# EAGLE design c64-stripefixvidbuf_v0.21-maxIC (EAGLE 6.0)
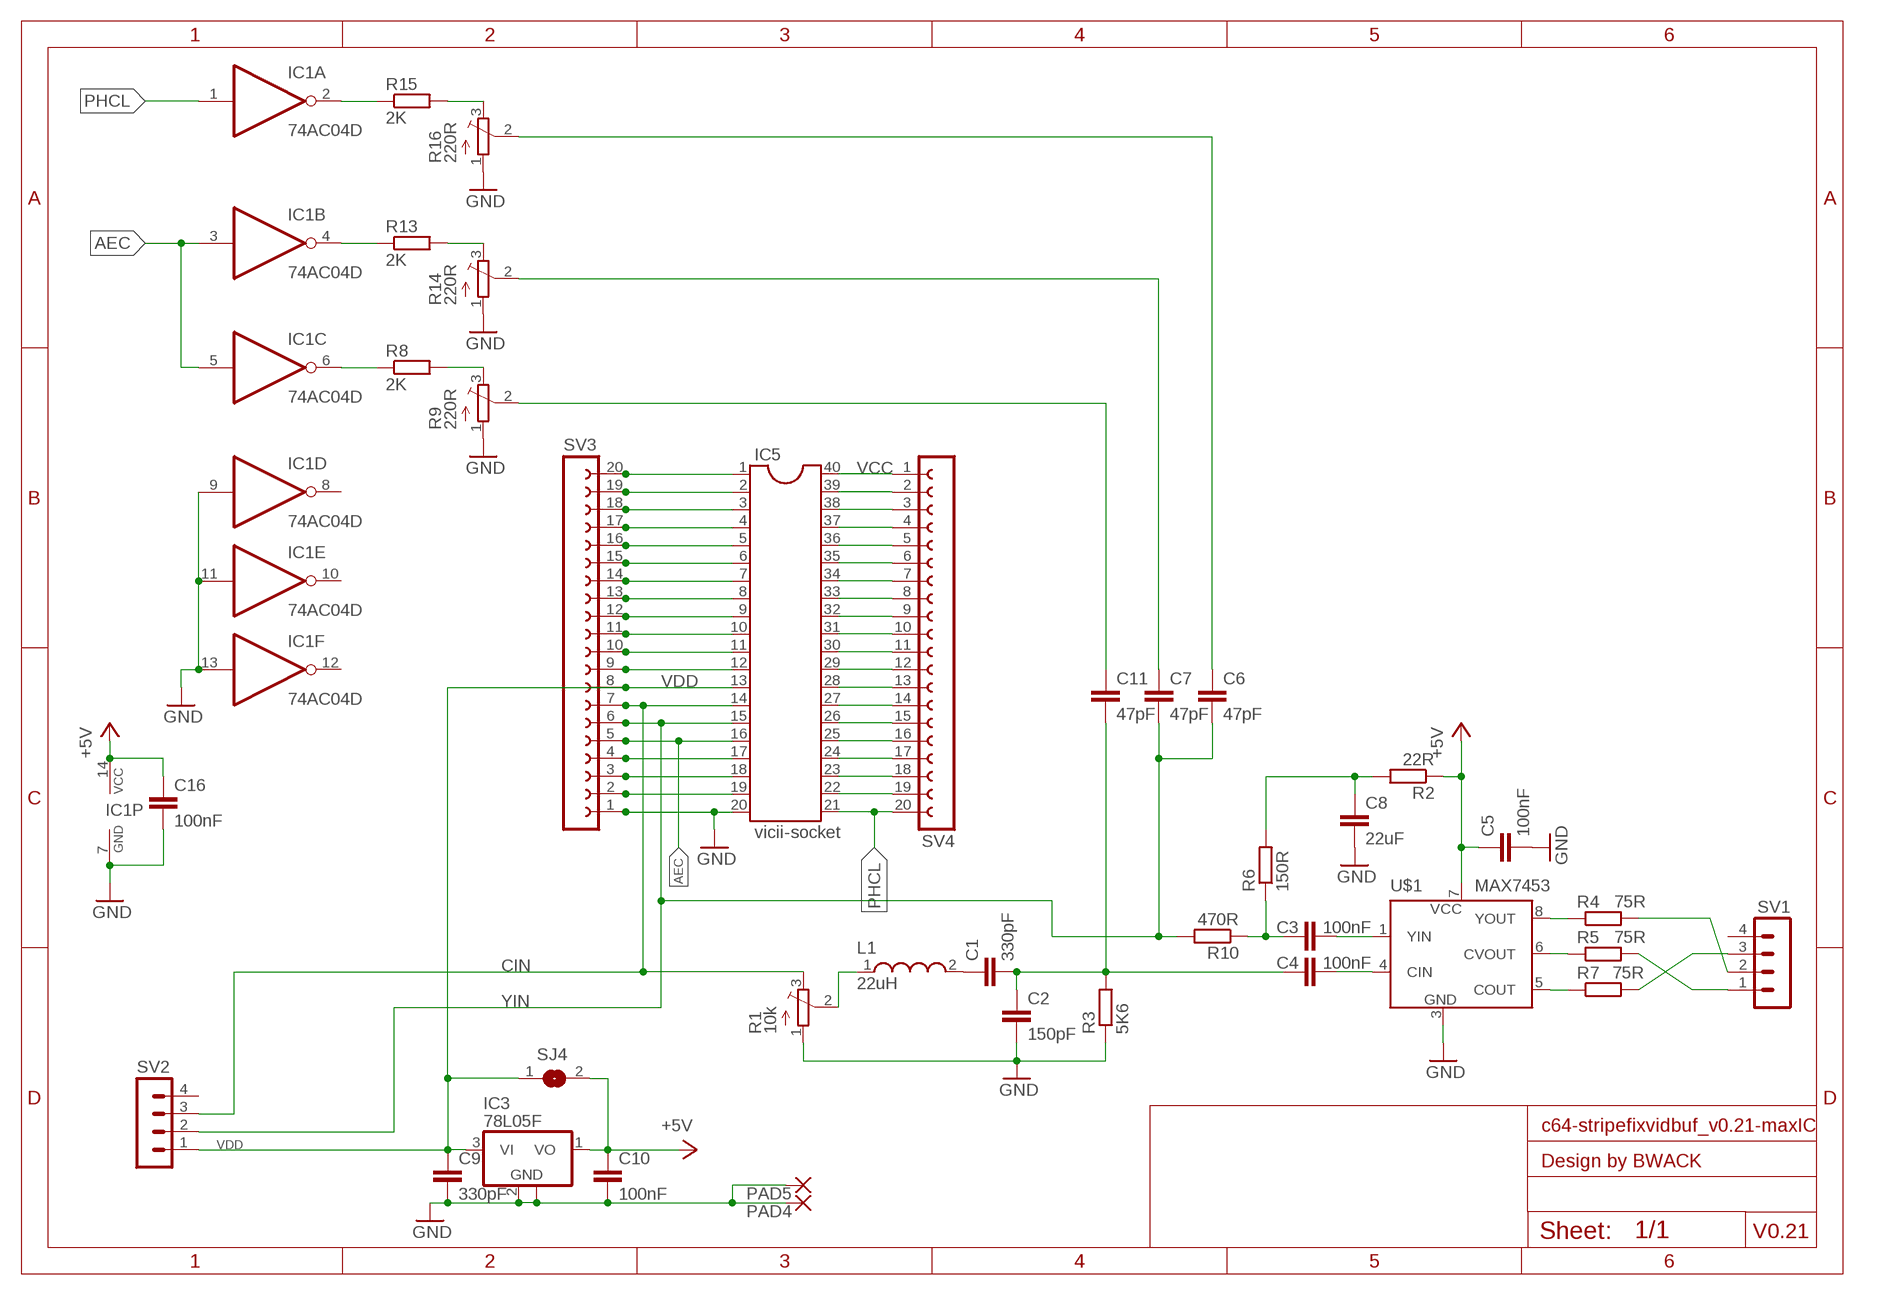
[diagram p0: schematic, sheet 1]

## Parts
C1  330pF  C-EUC0603  [C0603]
C2  150pF  C-EUC0603  [C0603]
C3  100nF  C-EUC0603  [C0603]
C4  100nF  C-EUC0603  [C0603]
C5  100nF  C-EUC0603  [C0603]
C6  47pF  C-EUC0603  [C0603]
C7  47pF  C-EUC0603  [C0603]
C8  22uF  C-EUC1206K  [C1206K]
C9  330pF  C-EUC0603  [C0603]
C10  100nF  C-EUC0603  [C0603]
C11  47pF  C-EUC0603  [C0603]
C16  100nF  C-EUC0603  [C0603]
IC1  74AC04D  [SO14]
IC3  78L05F  [SOT89]
IC5  vicii-socket  DIL40SPECIAL  [DIL40SPECIAL]
L1  22uH  WE-KIHQ_0805  [WE-KI_0805_B]
PAD4  2,15/1,0  [2,15/1,0]
PAD5  2,15/1,0  [2,15/1,0]
R1  10k  TRIM_EU-TC33  [TC33]
R2  22R  R-EU_R0603  [R0603]
R3  5K6  R-EU_R0603  [R0603]
R4  75R  R-EU_R0603  [R0603]
R5  75R  R-EU_R0603  [R0603]
R6  150R  R-EU_R0603  [R0603]
R7  75R  R-EU_R0603  [R0603]
R8  2K  R-EU_R0603  [R0603]
R9  220R  TRIM_EU-TC33  [TC33]
R10  470R  R-EU_R0603  [R0603]
R13  2K  R-EU_R0603  [R0603]
R14  220R  TRIM_EU-TC33  [TC33]
R15  2K  R-EU_R0603  [R0603]
R16  220R  TRIM_EU-TC33  [TC33]
SJ4  SJ  [SJ]
SV1  MA04-1S  [MA04-1S]
SV2  MA04-1S  [MA04-1S]
SV3  FE20-1  [FE20]
SV4  FE20-1  [FE20]
U$1  MAX7453  [SO08]

## Nets
+5V: C5.1 C10.1 C16.1 IC1.14(P:VCC) IC3.1(VO) R2.1 SJ4.2 U$1.7(V+)
AEC: IC1.3(B:I) IC1.5(C:I) IC5.16 SV3.5
CHROMA_OUT: R7.2 SV1.3
CIN: IC5.14 R1.3(E) SV2.3 SV3.7
COMPOSITE: R5.2 SV1.1
GND: C2.2 C5.2 C8.2 C9.2 C10.2 C16.2 IC1.7(P:GND) IC1.9(D:I) IC1.11(E:I) IC1.13(F:I) IC3.2(GND) IC3.2@1(GND) IC5.20 PAD4.1(P) PAD5.1(P) R1.1(A) R3.1 R9.1(A) R14.1(A) R16.1(A) SV3.1 U$1.3(V-)
LUMA_OUT: R4.2 SV1.2
N$1: R4.1 U$1.8(YOUT)
N$2: C1.2 C2.1 C4.1 C11.2 R3.2
N$3: IC5.22 SV4.19
N$4: IC5.23 SV4.18
N$5: IC1.4(B:O) R13.1
N$6: R8.2 R9.3(E)
N$7: R5.1 U$1.6(CVOUT)
N$8: C1.1 L1.2
N$9: IC5.24 SV4.17
N$10: R13.2 R14.3(E)
N$11: R7.1 U$1.5(COUT)
N$12: C6.1 R16.2(S)
N$13: C7.1 R14.2(S)
N$14: C3.2 U$1.1(YIN)
N$15: IC5.25 SV4.16
N$16: C4.2 U$1.4(CIN)
N$17: R15.2 R16.3(E)
N$18: IC1.6(C:O) R8.1
N$19: IC5.26 SV4.15
N$20: C8.1 R2.2 R6.2
N$21: L1.1 R1.2(S)
N$22: C11.1 R9.2(S)
N$23: IC1.2(A:O) R15.1
N$24: IC5.27 SV4.14
N$25: IC5.28 SV4.13
N$26: IC5.29 SV4.12
N$27: IC5.30 SV4.11
N$28: IC5.31 SV4.10
N$29: IC5.32 SV4.9
N$30: IC5.33 SV4.8
N$31: IC5.34 SV4.7
N$32: IC5.35 SV4.6
N$33: IC5.36 SV4.5
N$34: IC5.37 SV4.4
N$35: IC5.38 SV4.3
N$36: IC5.39 SV4.2
N$37: C3.1 R6.1 R10.1
N$39: IC5.19 SV3.2
N$40: IC5.18 SV3.3
N$41: IC5.17 SV3.4
N$46: IC5.12 SV3.9
N$47: IC5.11 SV3.10
N$48: IC5.10 SV3.11
N$49: IC5.9 SV3.12
N$50: IC5.8 SV3.13
N$51: IC5.7 SV3.14
N$52: IC5.6 SV3.15
N$53: IC5.5 SV3.16
N$54: IC5.4 SV3.17
N$55: IC5.3 SV3.18
N$56: IC5.2 SV3.19
N$57: IC5.1 SV3.20
PHCL: IC1.1(A:I) IC5.21 SV4.20
VCC: IC5.40 SV4.1
VDD: C9.1 IC3.3(VI) IC5.13 SJ4.1 SV2.1 SV3.8
YIN: C6.2 C7.2 IC5.15 R10.2 SV2.2 SV3.6
Unconnected: IC1.8(D:O) IC1.10(E:O) IC1.12(F:O) SV1.4 SV2.4

## Notes on the sheet
- Design by BWACK
- V0.21

## Library data of the parts
C1-C11 C16 = rcl:C-EU: CAPACITOR, European symbol
IC1 = 74xx-eu:74*04: Hex INVERTER
IC3 = linear:78L*: POSITOIV-VOLTAGE REGULATORS Output up to 100 mA Source: http://focus.ti.com/lit/ds/symlink/ua78l05.pdf
IC5 = ic-package_edit:DIL40: Dual In Line
L1 = Wurth_Elektronik_Passive_rev15f:WE-KIHQ: SMD Wire Wound Ceramic Inductor WE-KIHQ - High current - Highest Quality factor in size 0805 - up to 98 - High thermal stability - High SRF -- Bluetooth -- Wireless LAN -- RF oscillation circuit -- IF impedance matching -- IG choke
PAD4 PAD5 = wirepad:2,15/1,0: THROUGH-HOLE PAD
R1 R9 R14 R16 = pot:TRIM_EU-: POTENTIOMETER
R2-R8 R10 R13 R15 = resistor:R-EU_: RESISTOR, European symbol
SJ4 = jumper:SJ: SMD solder JUMPER
SV1 SV2 = con-lstb:MA04-1: PIN HEADER
SV3 SV4 = con-lsta:FE20-1: FEMALE HEADER; OC_FARNELL: unknown; OC_NEWARK: unknown
U$1 = maxim:MAX7453

## Board
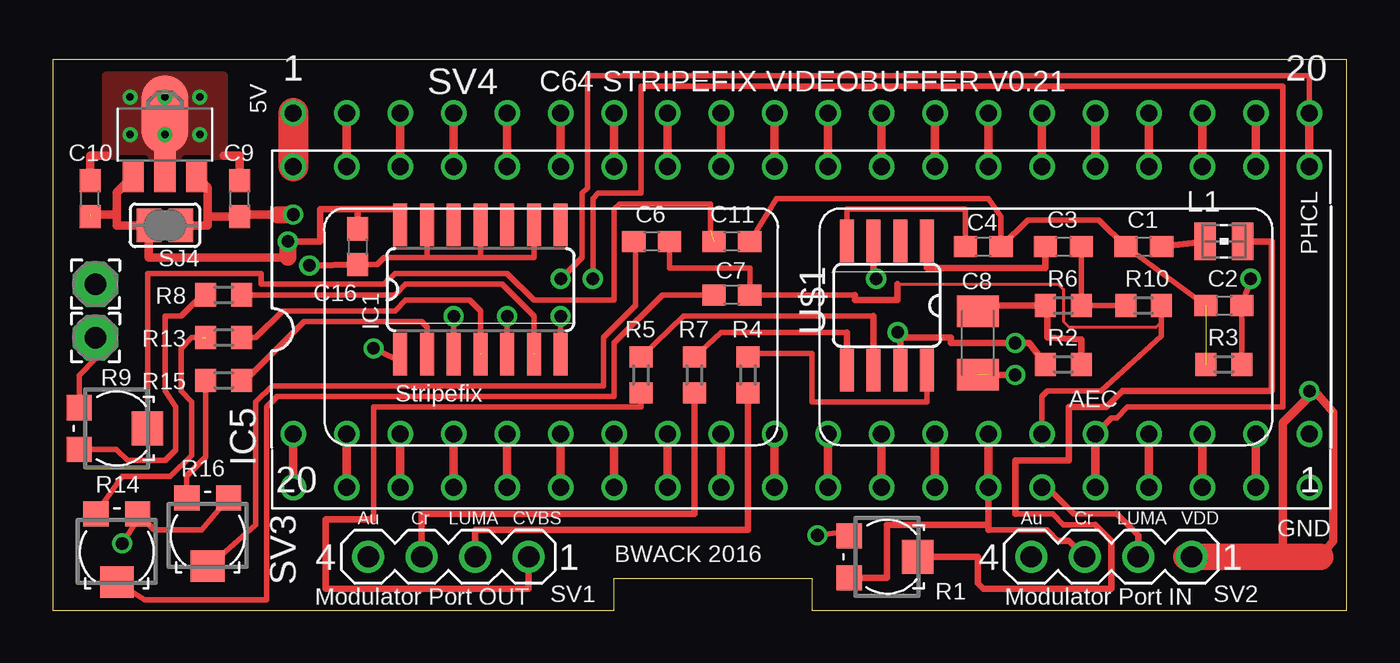
[diagram p1: board, top side]
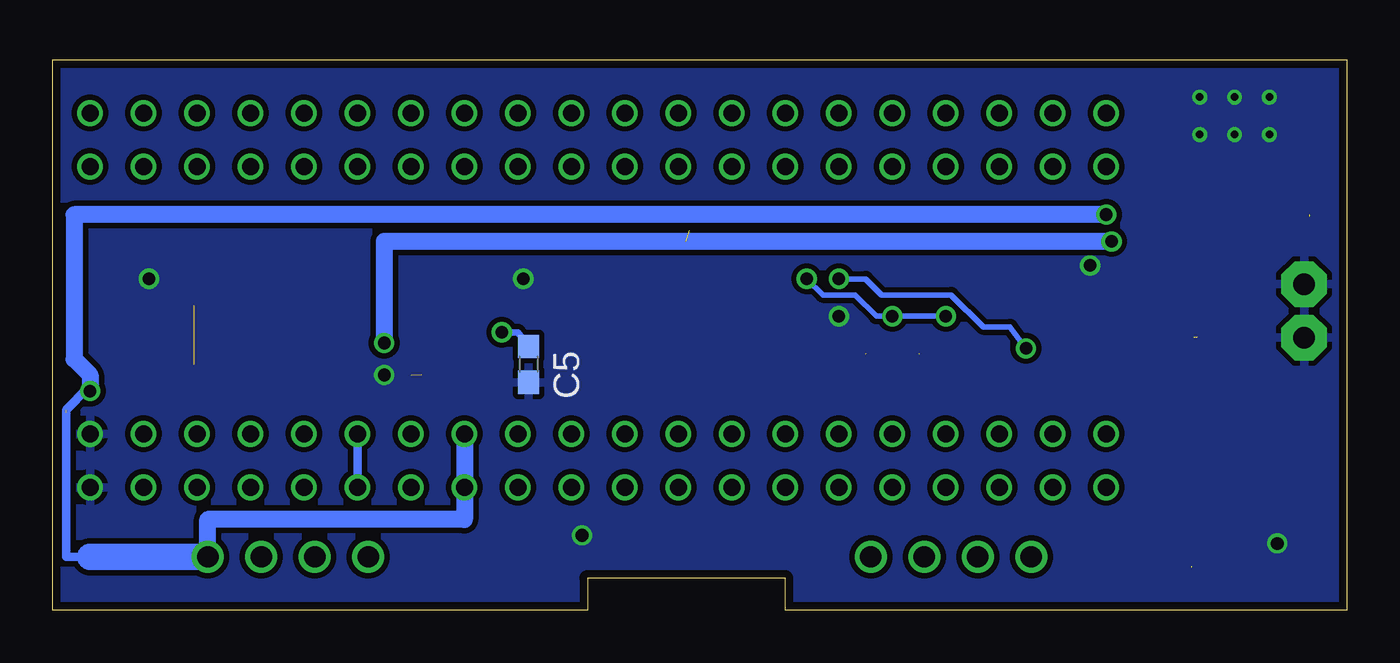
[diagram p2: board, bottom side, seen from below]

Size 61.47 x 26.16 mm. Coordinates in mm from the lower left corner, seen from the top.
Outline: 0,0 26.67,0 26.67,1.52 36.07,1.52 36.07,0 61.47,0 61.47,26.16 0,26.16 0,0
Copper layers (1*16): Top 0.0356mm / dielectric 1.5011mm / Bottom 0.0356mm
Design rules: minimum track width 6mil, minimum drill 13mil, track to track 6mil, track to pad 6mil, pad to pad 6mil, via to via 6mil, smd to smd 6mil, copper to edge 15mil, drill to drill 6mil, minimum pad ring 7mil, minimum via ring 7mil, stop-mask expansion 2.5mil, vias tented up to drill 0mil, thermal gap 10mil

### Footprints (pad centres in the part's own frame; a part is rotated, then mirrored left to right if it is on the bottom)
C0603 = smd 1.1 x 1: 1 -0.85,0; 2 0.85,0
C1206K = smd 1.5 x 2: 1 -1.5,0; 2 1.5,0
SO14 = smd 0.66 x 2.032: 1 -3.81,-3.073; 2 -2.54,-3.073; 3 -1.27,-3.073; 4 0,-3.073; 5 1.27,-3.073; 6 2.54,-3.073; 7 3.81,-3.073; 8 3.81,3.073; 9 2.54,3.073; 10 1.27,3.073; 11 0,3.073; 12 -1.27,3.073; 13 -2.54,3.073; 14 -3.81,3.073
SOT89 = smd 1 x 1.5: 1 -1.499,-1.981; 3 1.499,-1.981 | smd 1 x 2: 2 0,-1.727 | smd 2.2 x 3.7: 2@1 0,0.94
DIL40SPECIAL = drill 0.813: 1 0,0; 2 2.54,0; 3 5.08,0; 4 7.62,0; 5 10.16,0; 6 12.7,0; 7 15.24,0; 8 17.78,0; 9 20.32,0; 10 22.86,0; 11 25.4,0; 12 27.94,0; 13 30.48,0; 14 33.02,0; 15 35.56,0; 16 38.1,0; 17 40.64,0; 18 43.18,0; 19 45.72,0; 20 48.26,0; 21 48.26,15.24; 22 45.72,15.24; 23 43.18,15.24; 24 40.64,15.24; 25 38.1,15.24; 26 35.56,15.24; 27 33.02,15.24; 28 30.48,15.24; 29 27.94,15.24; 30 25.4,15.24; 31 22.86,15.24; 32 20.32,15.24; 33 17.78,15.24; 34 15.24,15.24; 35 12.7,15.24; 36 10.16,15.24; 37 7.62,15.24; 38 5.08,15.24; 39 2.54,15.24; 40 0,15.24
WE-KI_0805_B = smd 1.02 x 1.78: 1 -0.89,0; 2 0.89,0
2,15/1,0 = drill 1.016 pad 2.159 octagon: 1 0,0
TC33 = smd 1.194 x 1.194: 1 -0.991,-1.791; 3 0.991,-1.791 | smd 1.6 x 1.499: 2 0,1.46
R0603 = smd 1 x 1.1: 1 -0.85,0; 2 0.85,0
SJ = smd 1.168 x 1.6: 1 -0.762,0; 2 0.762,0
MA04-1S = drill 1.016: 1 -3.81,0; 2 -1.27,0; 3 1.27,0; 4 3.81,0
FE20 = drill 0.813: 1 -24.13,0; 2 -21.59,0; 3 -19.05,0; 4 -16.51,0; 5 -13.97,0; 6 -11.43,0; 7 -8.89,0; 8 -6.35,0; 9 -3.81,0; 10 -1.27,0; 11 1.27,0; 12 3.81,0; 13 6.35,0; 14 8.89,0; 15 11.43,0; 16 13.97,0; 17 16.51,0; 18 19.05,0; 19 21.59,0; 20 24.13,0
SO08 = smd 0.66 x 2.032: 1 -1.905,-3.073; 2 -0.635,-3.073; 3 0.635,-3.073; 4 1.905,-3.073; 5 1.905,3.073; 6 0.635,3.073; 7 -0.635,3.073; 8 -1.905,3.073

### Placement (x,y rotation side)
C1  51.82,17.27 180 top
C2  55.63,14.48 0 top
C3  48.01,17.27 180 top
C4  44.2,17.27 180 top
C5  38.86,11.68 270 bottom
C6  28.45,17.53 0 top
C7  32.26,14.99 0 top
C8  43.94,12.7 270 top
C9  8.89,19.56 90 top
C10  1.78,19.56 90 top
C11  32.26,17.53 0 top
C16  14.48,17.27 270 top
IC1  20.32,15.24 0 top
IC3  5.33,22.61 0 top
IC5  11.43,5.84 0 top
L1  55.63,17.53 180 top
PAD4  2.03,15.49 90 top
PAD5  2.03,12.95 90 top
R1  39.62,2.54 270 top
R2  48.01,11.68 0 top
R3  55.63,11.68 180 top
R4  33.02,11.18 270 top
R5  27.94,11.18 270 top
R6  48.01,14.48 180 top
R7  30.48,11.18 270 top
R8  8.13,14.99 180 top
R9  3.05,8.64 270 top
R10  51.82,14.48 0 top
R13  8.13,12.95 180 top
R14  3.05,2.79 180 top
R15  8.13,10.92 180 top
R16  7.37,3.56 180 top
SJ4  5.33,18.29 180 top
SV1  18.8,2.54 180 top
SV2  50.29,2.54 180 top
SV3  35.56,8.38 180 top
SV4  35.56,23.62 0 top
U$1  39.62,14.48 180 top

### Tracks (layer width: path | path; a pad name or v marks a point on that pad's centre or on a via)
+5V  (via drill 0.6)  (1 unrouted)
  Top 0.305: R2.1 46.39,12.7 v45.72,12.7 42.67,12.7 42.67,12.95 40.26,12.95 | U$1.7 40.26,12.95 | 14.48,19.05 16.51,19.05 IC1.14 | C16.1 14.48,19.05 | 14.48,19.05 12.7,19.05 12.7,17.53 v11.18,17.53 | v40.13,13.21 40.13,12.95 40.26,12.95
  Top 0.406: IC3.1 3.05,19.84 3.05,18.8 | 3.05,18.8 1.78,18.8 | 3.05,18.8 3.05,18.29 SJ4.2 4.57,16.76 11.18,16.76
  Top 0.813: 11.18,16.76 v11.18,17.53
  Bottom 0.305: C5.1 39.37,13.21 v40.13,13.21
  Bottom 0.813: v11.18,17.53 45.72,17.53 v45.72,12.7
AEC  (via drill 0.6)
  Top 0.254: IC1.3 v19.05,13.97 | v21.59,13.97 IC1.5 | SV3.5 50.29,9.14 50.55,9.14 51.05,9.65 58.42,9.65 58.42,24.89 27.94,24.89 27.94,19.81 25.91,19.81 25.65,19.56 v25.65,15.75
  Top 0.406: SV3.5 IC5.16
  Bottom 0.254: v19.05,13.97 v21.59,13.97 22.35,13.97 23.37,14.99 24.89,14.99 v25.65,15.75
CHROMA_OUT
  Top 0.305: R7.2 30.48,4.57 17.53,4.57 SV1.3
CIN
  Top 0.254: 47.75,3.3 47.24,3.81 44.45,3.81
  Top 0.305: SV2.3 48.26,3.3 47.75,3.3 | IC5.14 44.45,4.06 | 44.45,3.81 44.45,4.06 | 44.45,4.06 39.62,4.06 39.62,1.55 R1.3
  Top 0.406: SV3.7 IC5.14
COMPOSITE
  Top 0.254: R5.2 27.94,9.65 15.24,9.65 15.24,4.32
  Top 0.305: 15.24,4.32 12.95,4.32 12.95,1.02 22.61,1.02 SV1.1
GND  (via drill 0.36, 0.6, 0.6 pad 0.41)  (1 unrouted)
  Top 0.254: IC1.7 v24.13,13.97 | v3.3,3.17 4.04,4.29 R14.1 4.04,4.6 4.83,3.81 7.07,3.81 R16.1 | PAD5.1 2.03,11.94 1.26,11.16 R9.1 | C16.2 15.41,16.42 15.75,16.76 17.78,16.76 | IC1.13 17.78,16.76 | 20.32,16.76 17.78,16.76 | IC1.11 20.32,16.76 | 20.32,16.76 22.86,16.76 IC1.9 | R1.1 38.12,3.79 v36.32,3.56 | v56.9,15.75 C2.2 R3.1
  Top 0.305: v45.72,11.18 44.45,11.18 | U$1.3 38.99,15.75 v39.12,15.75 | C16.2 v12.19,16.38
  Top 0.406: C9.2 8.89,21.59 8.13,21.59 | C10.2 1.78,21.59 2.54,21.59
  other vias: 6.99,22.61 5.33,22.61 3.68,22.61 3.68,24.38 5.33,24.38 6.99,24.38
  pour Top (isolate 0.254, no thermals): 2.54,21.59 2.54,25.4 8.13,25.4 8.13,21.59
  pour Bottom (isolate 0.254): 0,26.16 61.47,26.16 61.47,-0.25 36.07,-0.25 36.07,1.52 26.67,1.52 26.67,0 0,0
LUMA_OUT
  Top 0.305: R4.2 33.02,3.81 20.07,3.81 SV1.2
N$1
  Top 0.254: 33.02,12.19 36.07,12.19 36.07,9.91 41.53,9.91 U$1.8
  Top 0.305: R4.1 33.02,12.19
N$2  (1 unrouted)
  Top 0.254: C2.1 C1.2 49.7,18.54 46.32,18.54 C4.1 45.05,18.71 44.45,19.56 34.38,19.56 C11.2
N$3
  Top 0.406: SV4.19 IC5.22
N$4
  Top 0.406: SV4.18 IC5.23
N$5  (1 unrouted)
  Top 0.254: R13.1 9.65,12.95 10.92,14.22 16.26,14.22 16.76,14.73 19.81,14.73 20.32,14.22 20.32,12.19
N$6
  Top 0.254: R9.3 3.02,7.64 3.56,7.11 5.33,7.11 5.84,7.62 5.84,9.65 5.33,10.41 5.33,13.97 6.1,13.97 7.11,14.99 R8.2
N$7
  Top 0.254: R5.1 29.97,13.97 38.99,13.97
  Top 0.305: U$1.6 38.99,13.97
N$8
  Top 0.305: C1.1 L1.2
N$9
  Top 0.406: SV4.17 IC5.24
N$10  (1 unrouted)
  Top 0.254: R14.3 3.31,6.35 5.59,6.35 6.6,7.37 6.6,9.91 6.1,10.41 6.1,12.45 6.6,12.95 7.11,12.95
N$11
  Top 0.254: R7.1 31.75,13.21 37.72,13.21
  Top 0.305: U$1.5 37.72,13.21
N$12  (1 unrouted)
  Top 0.254: C6.1 27.69,17.53 27.69,14.48 26.16,12.95 26.16,10.67 10.41,10.67 9.65,9.91 9.65,4.06 7.37,2.03
N$13
  Top 0.254: R14.2 4.38,0.51 10.16,0.51 10.16,9.65 10.67,10.16 26.67,10.16 26.67,12.7 28.96,14.99 C7.1
N$14
  Top 0.305: C3.2 47.16,16.26 41.53,16.26 U$1.1
N$15
  Top 0.406: SV4.16 IC5.25
N$16
  Top 0.254: C4.2 43.35,19.05 37.72,19.05 U$1.4
N$17
  Top 0.254: R16.3 6.38,6.38 7.28,7.28 R15.2
N$18  (1 unrouted)
  Top 0.254: R8.1 16.26,14.99 16.76,15.49 21.34,15.49 22.86,13.97 22.86,12.19
N$19
  Top 0.406: SV4.15 IC5.26
N$20
  Top 0.305: C8.1 44.47,14.48 R6.2 47.24,14.39 47.24,12.95 48.86,12.87 R2.2
N$21
  Top 0.254: 49.53,4.06 48.01,4.06 47.5,4.57 45.72,4.57
  Top 0.305: R1.2 43.94,2.54 43.94,1.27 44.2,1.02 50.29,1.02 50.29,3.3 49.53,4.06 | 45.72,4.57 45.72,7.11 48.26,7.11 48.26,9.65 50.04,9.65 50.8,10.41 57.91,10.41 57.91,17.53 L1.1
N$22  (1 unrouted)
  Top 0.254: R9.2 4.51,16 9.91,16 9.91,15.49 15.75,15.49 16.26,16 21.59,16 22.86,14.73 26.67,14.73 26.67,19.05 26.92,19.3 31.24,19.3 31.24,18.03
N$23
  Top 0.254: R15.1 9.14,10.92 11.94,13.72 17.53,13.72 17.78,13.46 IC1.2
N$24
  Top 0.406: SV4.14 IC5.27
N$25
  Top 0.406: SV4.13 IC5.28
N$26
  Top 0.406: SV4.12 IC5.29
N$27
  Top 0.406: SV4.11 IC5.30
N$28
  Top 0.406: SV4.10 IC5.31
N$29
  Top 0.406: SV4.9 IC5.32
N$30
  Top 0.406: SV4.8 IC5.33
N$31
  Top 0.406: SV4.7 IC5.34
N$32
  Top 0.406: SV4.6 IC5.35
N$33
  Top 0.406: SV4.5 IC5.36
N$34
  Top 0.406: SV4.4 IC5.37
N$35
  Top 0.406: SV4.3 IC5.38
N$36
  Top 0.406: SV4.2 IC5.39
N$37
  Top 0.254: C3.1 R6.1 R10.1
N$39
  Top 0.406: SV3.2 IC5.19
N$40
  Top 0.406: SV3.3 IC5.18
N$41
  Top 0.406: SV3.4 IC5.17
N$46
  Top 0.406: SV3.9 IC5.12
N$47
  Top 0.406: SV3.10 IC5.11
N$48
  Top 0.406: IC5.10 SV3.11
N$49
  Top 0.406: IC5.9 SV3.12
N$50
  Top 0.406: IC5.8 SV3.13
N$51
  Top 0.406: IC5.7 SV3.14
N$52
  Top 0.406: IC5.6 SV3.15
N$53
  Top 0.406: IC5.5 SV3.16
N$54
  Top 0.406: SV3.17 IC5.4
N$55
  Top 0.406: IC5.3 SV3.18
N$56
  Top 0.406: IC5.2 SV3.19
N$57
  Top 0.406: IC5.1 SV3.20
PHCL  (via drill 0.6)
  Top 0.254: IC5.21 59.69,25.4 25.4,25.4 25.4,20.07 25.15,19.81 25.15,16.76 v24.13,15.75 | v15.24,12.45 16.28,11.94 IC1.1
  Top 0.406: SV4.20 IC5.21
  Bottom 0.254: v24.13,15.75 22.86,15.75 22.1,14.99 18.8,14.99 17.27,13.46 16,13.46 v15.24,12.45
VCC
  Top 1.422: SV4.1 IC5.40
VDD  (via drill 0.6)  (1 unrouted)
  Top 0.406: IC3.3 7.37,20.09 7.37,18.71 | SJ4.1 7.37,18.29 7.37,18.71 | 7.37,18.71 C9.1 8.89,18.8 10.67,18.8 | SV3.8 IC5.13 | 60.2,2.54 60.83,3.3 60.83,9.4 59.94,10.41 | 59.94,10.41 v59.69,10.41 | 59.94,10.41 58.42,8.89 58.42,2.54
  Top 0.813: 10.67,18.8 v11.43,18.8
  Top 1.27: 53.85,2.54 58.42,2.54 60.2,2.54
  Bottom 0.406: 59.69,2.54 60.83,2.54 60.83,9.53 59.82,10.54
  Bottom 0.813: SV2.1 54.1,4.32 41.91,4.32 IC5.13 SV3.8 | v11.43,18.8 60.45,18.8 60.45,11.94 59.69,11.18 v59.69,10.41
  Bottom 1.27: SV2.1 59.69,2.54
YIN
  Top 0.152: 40.13,15.49 47.75,15.49 48.01,15.24 48.01,13.72 48.26,13.46 52.41,13.46 52.67,13.72
  Top 0.254: 47.24,5.84 48.51,4.57 50.55,4.57 | 38.1,14.99 C7.2 33.11,16.26 29.3,16.26 C6.2 | SV3.6 46.99,10.16 47.24,10.41 49.78,10.41 52.67,13.04 52.67,13.72 R10.2 52.67,14.9
  Top 0.305: IC5.15 47.24,5.84 | 50.55,4.57 51.56,3.56 SV2.2 | 38.1,14.99 38.1,14.73 40.13,14.73 40.13,15.49
  Bottom 0.406: IC5.15 SV3.6

### Text on the board
tPlace: C64 STRIPEFIX VIDEOBUFFER V0.21 | 5V | Stripefix | Au | Cr | LUMA | CVBS | Au | Cr | LUMA | VDD | GND | BWACK 2016 | Modulator Port OUT | Modulator Port IN
tNames: PHCL | AEC